# EAGLE design M217A (EAGLE 6.6.0)
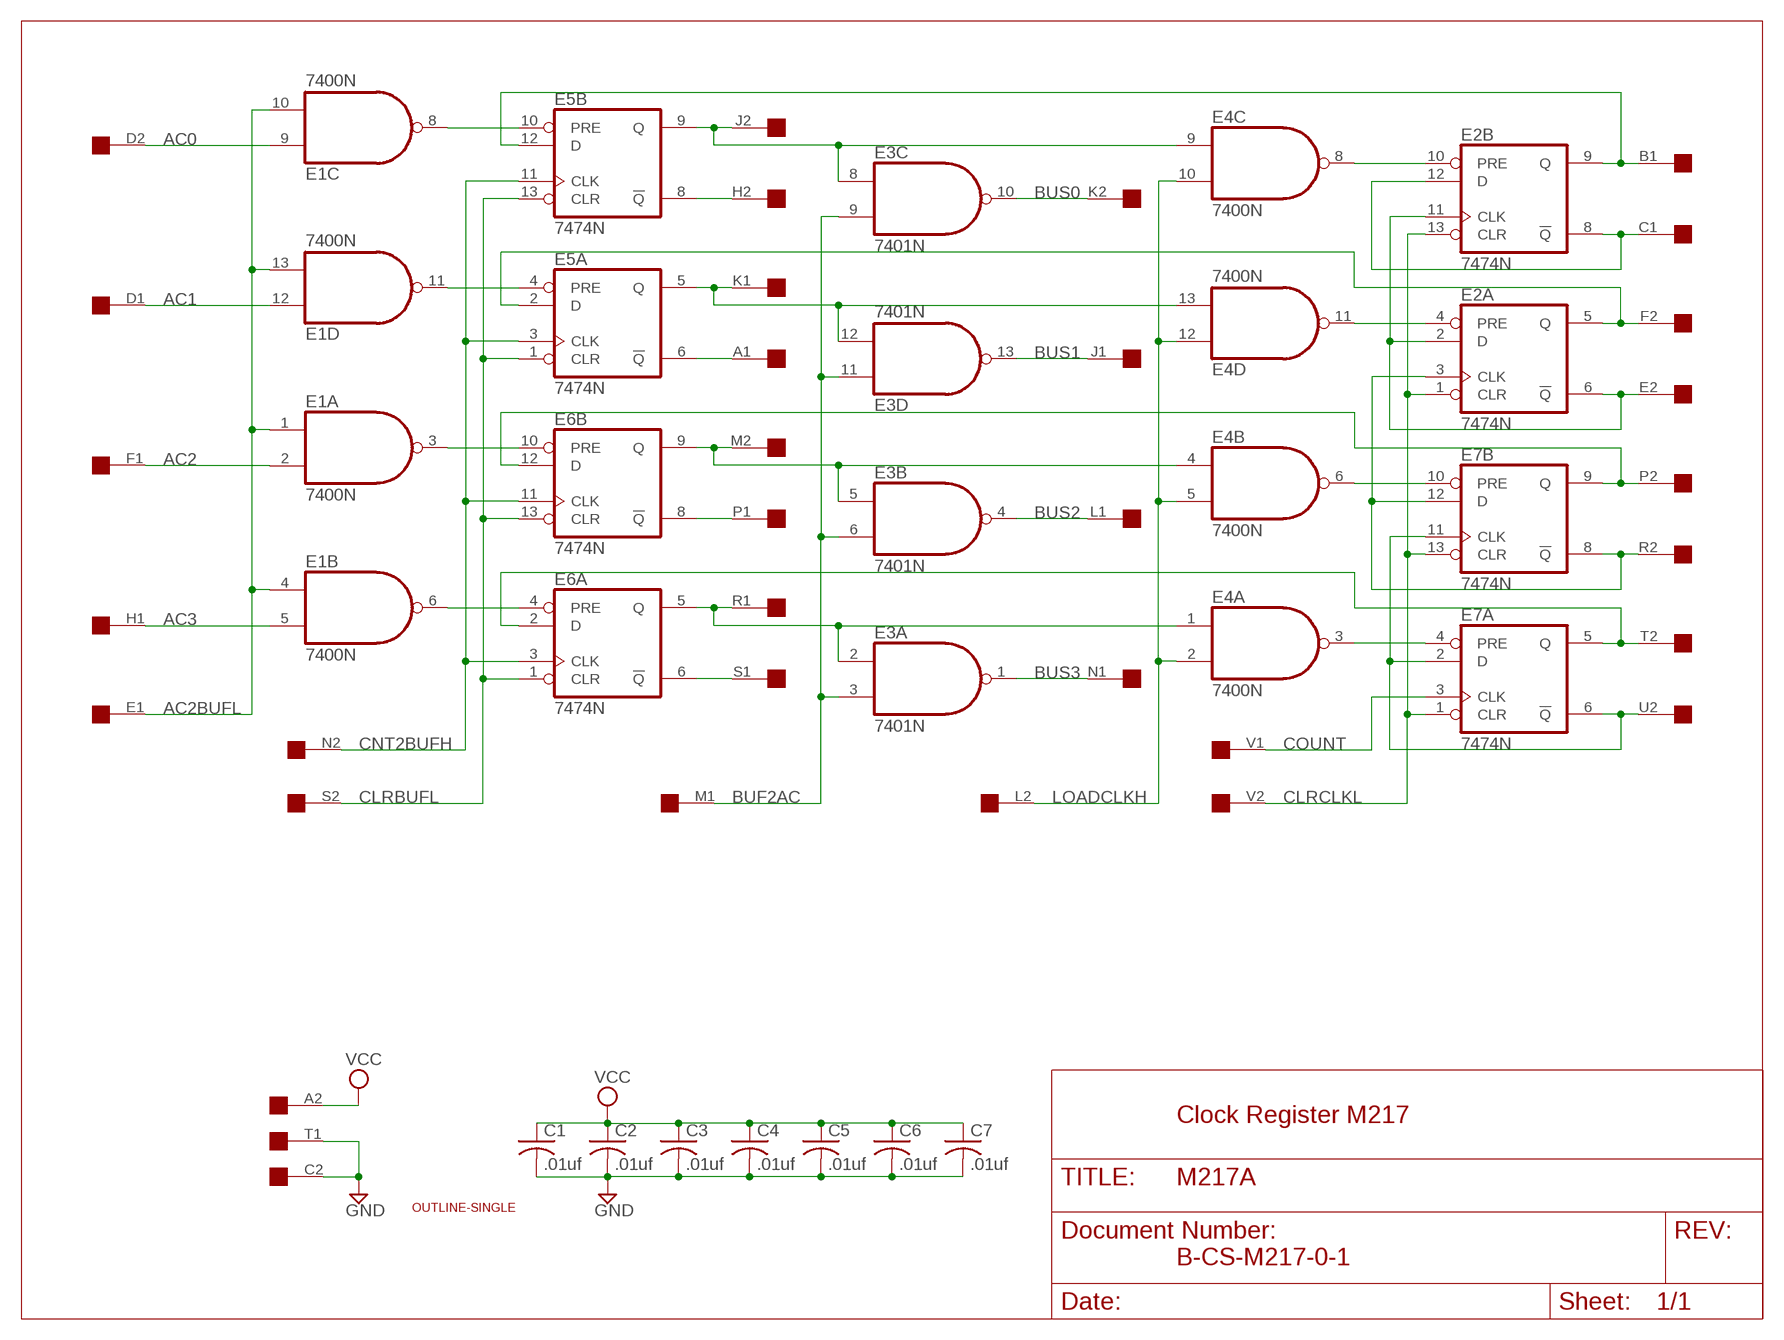
[diagram p0: schematic, sheet 1]

## Parts
C1  .01uf  C-US050-025X075  [C050-025X075]
C2  .01uf  C-US050-025X075  [C050-025X075]
C3  .01uf  C-US050-025X075  [C050-025X075]
C4  .01uf  C-US050-025X075  [C050-025X075]
C5  .01uf  C-US050-025X075  [C050-025X075]
C6  .01uf  C-US050-025X075  [C050-025X075]
C7  .01uf  C-US050-025X075  [C050-025X075]
E1  7400N  [DIL14]
E2  7474N  74S74N  [DIL14]
E3  7401N  74LS01N  [DIL14]
E4  7400N  [DIL14]
E5  7474N  74S74N  [DIL14]
E6  7474N  74S74N  [DIL14]
E7  7474N  74S74N  [DIL14]
U$1  OUTLINE-SINGLE  [SINGLE]
U$4  SINGLE  [EDGE-CON2]

## Nets
AC0: E1.9(C:I0) U$4.D2
AC1: E1.12(D:I0) U$4.D1
AC2: E1.2(A:I1) U$4.F1
AC2BUFL: E1.1(A:I0) E1.4(B:I0) E1.10(C:I1) E1.13(D:I1) U$4.E1
AC3: E1.5(B:I1) U$4.H1
BUF2AC: E3.3(A:I1) E3.6(B:I1) E3.9(C:I1) E3.11(D:I0) U$4.M1
BUS0: E3.10(C:O) U$4.K2
BUS1: E3.13(D:O) U$4.J1
BUS2: E3.4(B:O) U$4.L1
BUS3: E3.1(A:O) U$4.N1
CLRBUFL: E5.1(A:CLR) E5.13(B:CLR) E6.1(A:CLR) E6.13(B:CLR) U$4.S2
CLRCLKL: E2.1(A:CLR) E2.13(B:CLR) E7.1(A:CLR) E7.13(B:CLR) U$4.V2
CNT2BUFH: E5.3(A:CLK) E5.11(B:CLK) E6.3(A:CLK) E6.11(B:CLK) U$4.N2
COUNT: E7.3(A:CLK) U$4.V1
GND [Supply]: C1.2 C2.2 C3.2 C4.2 C5.2 C6.2 C7.2 U$4.C2 U$4.T1
LOADCLKH: E4.2(A:I1) E4.5(B:I1) E4.10(C:I1) E4.12(D:I0) U$4.L2
N$1: E6.12(B:D) E7.9(B:Q) U$4.P2
N$2: E2.5(A:Q) E5.2(A:D) U$4.F2
N$6: E1.6(B:O) E6.4(A:PRE)
N$7: E1.3(A:O) E6.10(B:PRE)
N$8: E1.11(D:O) E5.4(A:PRE)
N$9: E1.8(C:O) E5.10(B:PRE)
N$12: E3.8(C:I0) E4.9(C:I0) E5.9(B:Q) U$4.J2
N$13: E5.8(B:!Q) U$4.H2
N$14: E3.12(D:I1) E4.13(D:I1) E5.5(A:Q) U$4.K1
N$15: E5.6(A:!Q) U$4.A1
N$16: E3.5(B:I0) E4.4(B:I0) E6.9(B:Q) U$4.M2
N$17: E6.8(B:!Q) U$4.P1
N$18: E3.2(A:I0) E4.1(A:I0) E6.5(A:Q) U$4.R1
N$19: E6.6(A:!Q) U$4.S1
N$26: E4.3(A:O) E7.4(A:PRE)
N$27: E4.6(B:O) E7.10(B:PRE)
N$28: E2.4(A:PRE) E4.11(D:O)
N$29: E2.10(B:PRE) E4.8(C:O)
N$31: E7.2(A:D) E7.6(A:!Q) E7.11(B:CLK) U$4.U2
N$32: E6.2(A:D) E7.5(A:Q) U$4.T2
N$33: E2.3(A:CLK) E7.8(B:!Q) E7.12(B:D) U$4.R2
N$35: E2.2(A:D) E2.6(A:!Q) E2.11(B:CLK) U$4.E2
N$37: E2.9(B:Q) E5.12(B:D) U$4.B1
N$38: E2.8(B:!Q) E2.12(B:D) U$4.C1
VCC [Supply]: C1.1 C2.1 C3.1 C4.1 C5.1 C6.1 C7.1 U$4.A2
Unconnected: U$4.B2 U$4.U1

## Notes on the sheet
- Clock Register M217
- B-CS-M217-0-1

## Power pins joined to a net without a drawn wire
GND: E1.7(P:GND) E2.7(P:GND) E3.7(P:GND) E4.7(P:GND) E5.7(P:GND) E6.7(P:GND) E7.7(P:GND)
VCC: E1.14(P:VCC) E2.14(P:VCC) E3.14(P:VCC) E4.14(P:VCC) E5.14(P:VCC) E6.14(P:VCC) E7.14(P:VCC)

## Library data of the parts
C1-C7 = rcl:C-US: CAPACITOR, American symbol
E1 E4 = 74xx-us:74*00: Quad 2-input NAND gate
E2 E5-E7 = 74xx-us:74*74: Dual D type positive edge triggered FLIP FLOP, preset and clear
E3 = 74xx-us:74*01: Quad 2-input NAND gate, open collector
U$1 = dec-con:OUTLINE-*: Board outlines for DEC boards.
U$4 = dec-con:SINGLE: Single-Height DEC board

## Net classes
1 Supply: width 0.813 mm

## Board
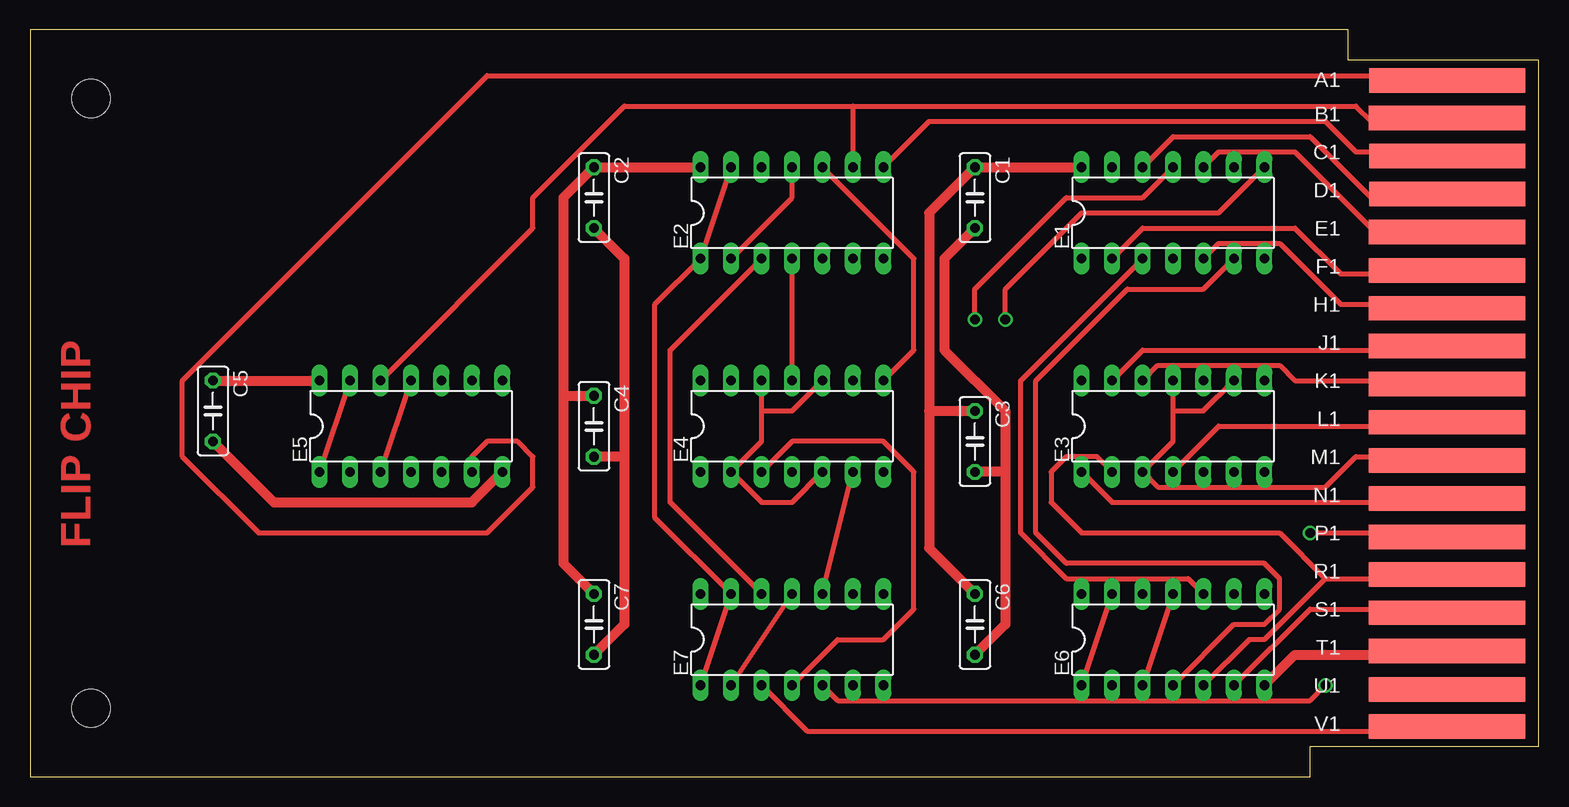
[diagram p1: board, top side]
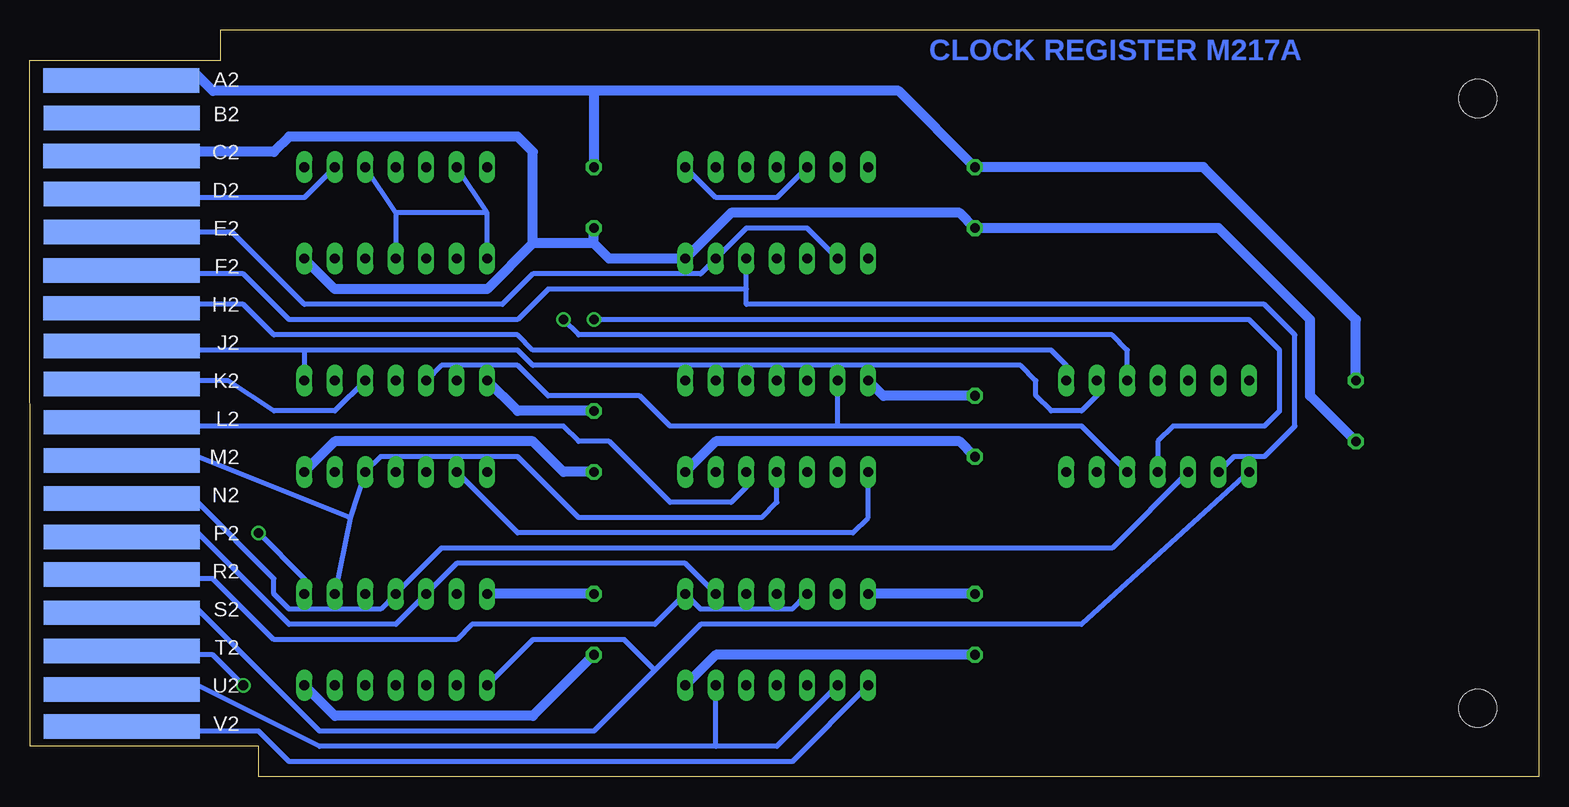
[diagram p2: board, bottom side, seen from below]

Size 125.73 x 62.23 mm. Coordinates in mm from the lower left corner, seen from the top.
Copper layers (1+16): Top 0.035mm / dielectric 1.5mm / Bottom 0.035mm
Design rules "16mils": minimum track width 16mil, minimum drill 32mil, track to track 15mil, track to pad 10mil, pad to pad 10mil, via to via 10mil, smd to smd 10mil, copper to edge 25mil, drill to drill 10mil, minimum pad ring 10mil, minimum via ring 8mil, stop-mask expansion 0mil, vias tented up to drill 0mil, thermal gap 10mil

### Footprints (pad centres in the part's own frame; a part is rotated, then mirrored left to right if it is on the bottom)
C050-025X075 = drill 0.813 octagon: 1 -2.54,0; 2 2.54,0
DIL14 = drill 0.813 long: 1 -7.62,-3.81; 2 -5.08,-3.81; 3 -2.54,-3.81; 4 0,-3.81; 5 2.54,-3.81; 6 5.08,-3.81; 7 7.62,-3.81; 8 7.62,3.81; 9 5.08,3.81; 10 2.54,3.81; 11 0,3.81; 12 -2.54,3.81; 13 -5.08,3.81; 14 -7.62,3.81
SINGLE = hole 3.175: 120.65,56.515; 120.65,5.715
EDGE-CON2 = smd 13.017 x 2.032: A1 7.633,4.207; B1 7.639,7.327; C1 7.636,10.489; D1 7.633,13.665; E1 7.642,16.84; F1 7.642,20.041; H1 7.642,23.19; J1 7.642,26.34; K1 7.642,29.515; L1 7.642,32.69; M1 7.642,35.89; N1 7.642,39.04; P1 7.642,42.24; R1 7.642,45.39; S1 7.642,48.565; T1 7.642,51.74; U1 7.642,54.966; V1 7.642,58.026 | smd 13.017 x 2.032 bottom: A2 7.614,4.207; B2 7.642,7.328; C2 7.617,10.49; D2 7.642,13.665; E2 7.642,16.84; F2 7.617,20.041; H2 7.617,23.19; J2 7.642,26.34; K2 7.642,29.515; L2 7.642,32.69; M2 7.642,35.89; N2 7.642,39.04; P2 7.642,42.24; R2 7.642,45.39; S2 7.642,48.565; T2 7.642,51.74; U2 7.642,54.966; V2 7.642,58.026

### Placement (x,y rotation side)
C1  78.74,48.26 270 top
C2  46.99,48.26 270 top
C3  78.74,27.94 270 top
C4  46.99,29.21 270 top
C5  15.24,30.48 270 top
C6  78.74,12.7 270 top
C7  46.99,12.7 270 top
E1  95.25,46.99 0 top
E2  63.5,46.99 0 top
E3  95.25,29.21 0 top
E4  63.5,29.21 0 top
E5  31.75,29.21 0 top
E6  95.25,11.43 0 top
E7  63.5,11.43 0 top
U$1  125.73,62.23 180 top
U$4  125.73,62.23 180 top
U$5  [FLIPCHIP]  0,0 0 top

### Tracks (layer width: path | path; a pad name or v marks a point on that pad's centre or on a via)
AC0
  Bottom 0.406: U$4.D2 115.88,48.56 115.57,48.26 102.87,48.26 E1.9
AC1
  Top 0.406: U$4.D1 115.88,48.56 115.57,48.26 111.76,48.26 106.68,53.34 95.25,53.34 E1.12
AC2
  Top 0.406: U$4.F1 117.12,42.19 116.84,41.91 109.22,41.91 105.41,45.72 92.71,45.72 E1.2
AC2BUFL
  Top 0.406: U$4.E1 115.9,45.39 115.57,45.72 111.76,45.72 105.41,52.07 99.06,52.07 E1.10
  Bottom 0.406: 95.25,46.99 E1.4 | 95.25,46.99 E1.10 | E1.1 87.63,46.99 | 87.63,46.99 E1.13 | 87.63,46.99 95.25,46.99
AC3
  Top 0.406: U$4.H1 115.9,39.04 115.57,39.37 109.22,39.37 104.14,44.45 99.06,44.45 E1.5
BUF2AC
  Top 0.406: 100.33,24.13 93.98,24.13 E3.3 95.25,27.94 95.25,30.48 | U$4.M1 116.84,26.67 110.49,26.67 107.95,24.13 100.33,24.13 | 100.33,24.13 E3.6 | 95.25,30.48 E3.11 | E3.9 97.79,30.48 95.25,30.48
BUS0
  Bottom 0.406: U$4.K2 116.84,33.02 109.22,33.02 105.41,30.48 100.33,30.48 E3.10
BUS1
  Top 0.406: E3.13 92.71,35.56 116.84,35.56 U$4.J1
BUS2
  Top 0.406: U$4.L1 116.84,29.21 99.06,29.21 E3.4
BUS3
  Top 0.406: U$4.N1 117.17,23.19 116.84,22.86 90.17,22.86 E3.1
CLRBUFL
  Top 0.406: E5.1 E5.13 | E6.1 E6.13
  Bottom 0.406: E5.1 38.1,12.7 69.85,12.7 73.66,8.89 | 73.66,8.89 78.74,3.81 101.6,3.81 111.76,13.97 116.84,13.97 117.14,13.66 U$4.S2 | E6.1 83.82,11.43 76.2,11.43 73.66,8.89
CLRCLKL
  Top 0.406: E7.1 E7.13 52.07,21.59 52.07,39.37 E2.1 E2.13
  Bottom 0.406: U$4.V2 117.23,4.2 116.84,3.81 106.68,3.81 104.14,1.27 62.23,1.27 E7.1
CNT2BUFH
  Top 0.406: E5.3 E5.11 | E6.11 E6.3
  Bottom 0.406: U$4.N2 117.17,23.19 116.84,22.86 111.76,22.86 105.41,16.51 105.41,15.24 104.14,13.97 96.52,13.97 E6.11 91.44,19.05 35.56,19.05 E5.3
COUNT
  Top 0.406: U$4.V1 117.23,4.2 116.84,3.81 64.77,3.81 E7.3
GND
  Top 0.813: C6.2 81.28,12.7 81.28,25.4 | 81.28,25.4 C3.2 | 81.28,25.4 81.28,30.48 76.2,35.56 76.2,43.18 C1.2 | U$4.T1 117.17,10.49 116.84,10.16 105.41,10.16 E6.7 | 49.53,26.67 49.53,12.7 C7.2 | 49.53,26.67 C4.2 | 49.53,26.67 49.53,43.18 C2.2 | E5.7 36.83,22.86 20.32,22.86 C5.2
  Bottom 0.813: U$4.C2 115.9,51.74 115.57,52.07 105.41,52.07 104.14,53.34 85.09,53.34 83.82,52.07 83.82,44.45 | 83.82,44.45 87.63,40.64 100.33,40.64 E1.7 | 78.74,44.45 83.82,44.45 | 78.74,44.45 C1.2 | 78.74,44.45 77.47,43.18 E2.7 67.31,46.99 48.26,46.99 C2.2 26.67,45.72 19.05,38.1 19.05,31.75 C5.2 | C4.2 48.26,27.94 68.58,27.94 E4.7 | E6.7 100.33,5.08 83.82,5.08 C6.2 | C7.2 68.58,10.16 E7.7 | E3.7 100.33,27.94 83.82,27.94 81.28,25.4 C3.2
LOADCLKH
  Top 0.406: E4.5 63.5,22.86 60.96,22.86 E4.2 60.96,27.94 60.96,30.48 | 60.96,30.48 E4.12 | 60.96,30.48 63.5,30.48 E4.10
  Bottom 0.406: E4.5 66.04,24.13 67.31,22.86 72.39,22.86 77.47,27.94 80.01,27.94 81.28,29.21 115.57,29.21 115.9,29.54 U$4.L2
N$1
  Bottom 0.406: U$4.P2 115.9,19.99 115.57,20.32 111.76,20.32 104.14,12.7 95.25,12.7 E6.12 90.17,17.78 71.12,17.78 E7.9
N$2
  Bottom 0.406: E5.2 25.4,26.67 22.86,26.67 20.32,29.21 20.32,36.83 22.86,39.37 66.04,39.37 66.04,40.64 | 66.04,40.64 E2.5 | U$4.F2 117.12,42.19 116.84,41.91 107.95,41.91 104.14,38.1 85.09,38.1 82.55,40.64 66.04,40.64
N$6
  Top 0.406: E6.4 100.33,12.7 102.87,12.7 104.14,13.97 104.14,16.51 102.87,17.78 86.36,17.78 83.82,20.32 83.82,33.02 91.44,40.64 97.79,40.64 E1.6
N$7
  Top 0.406: E6.10 96.52,16.51 86.36,16.51 82.55,20.32 82.55,33.02 E1.3
N$8  (via drill 0.81)
  Top 0.406: v78.74,38.1 78.74,40.64 86.36,48.26 92.71,48.26 E1.11
  Bottom 0.406: E5.4 31.75,27.94 30.48,29.21 22.86,29.21 21.59,30.48 21.59,35.56 24.13,38.1 v78.74,38.1
N$9  (via drill 0.81)
  Top 0.406: v81.28,38.1 81.28,40.64 87.63,46.99 99.06,46.99 E1.8
  Bottom 0.406: E5.10 34.29,35.56 35.56,36.83 80.01,36.83 v81.28,38.1
N$12
  Bottom 0.406: E5.9 36.83,31.75 38.1,30.48 40.64,30.48 41.91,31.75 41.91,33.02 43.18,34.29 68.58,34.29 | 68.58,34.29 E4.9 | 68.58,34.29 83.82,34.29 85.09,35.56 102.87,35.56 | 102.87,35.56 E3.8 | U$4.J2 117.17,35.89 116.84,35.56 102.87,35.56
N$13
  Bottom 0.406: E5.8 39.37,34.29 40.64,35.56 83.82,35.56 85.09,36.83 105.41,36.83 107.95,39.37 116.84,39.37 117.17,39.04 U$4.H2
N$14
  Top 0.406: E3.12 93.98,34.29 104.14,34.29 105.41,33.02 116.84,33.02 U$4.K1
  Bottom 0.406: E5.5 38.1,29.21 58.42,29.21 | 58.42,29.21 72.39,29.21 74.93,31.75 82.55,31.75 85.09,34.29 91.44,34.29 E3.12 | 58.42,29.21 E4.13
N$15
  Top 0.406: U$4.A1 115.97,58.02 115.57,58.42 38.1,58.42 12.7,33.02 12.7,26.67 19.05,20.32 38.1,20.32 41.91,24.13 41.91,26.67 40.64,27.94 38.1,27.94 36.83,26.67 E5.6
N$16
  Bottom 0.406: E4.4 63.5,22.86 64.77,21.59 80.01,21.59 85.09,26.67 96.52,26.67 E3.5 99.06,21.59 | U$4.M2 116.84,26.67 111.76,26.67 99.06,21.59 | 99.06,21.59 E6.9
N$17  (via drill 0.81)
  Top 0.406: U$4.P1 116.84,20.32 v106.68,20.32
  Bottom 0.406: v106.68,20.32 102.87,16.51 E6.8
N$18
  Top 0.406: U$4.R1 115.9,16.84 115.57,16.51 107.95,16.51 | 107.95,16.51 102.87,11.43 101.6,11.43 E6.5 | E3.2 88.9,26.67 86.36,26.67 85.09,25.4 85.09,22.86 87.63,20.32 104.14,20.32 107.95,16.51
  Bottom 0.406: E4.1 55.88,21.59 57.15,20.32 85.09,20.32 E3.2
N$19
  Top 0.406: U$4.S1 117.14,13.66 116.84,13.97 106.68,13.97 E6.6
N$26
  Top 0.406: E4.3 63.5,27.94 71.12,27.94 73.66,25.4 73.66,13.97 71.12,11.43 67.31,11.43 E7.4
N$27
  Top 0.406: E7.10 E4.6
N$28
  Top 0.406: E4.11 E2.4
N$29
  Top 0.406: E4.8 73.66,35.56 73.66,43.18 E2.10
N$31
  Top 0.406: E7.2 E7.11
  Bottom 0.406: U$4.U2 115.93,7.26 115.57,7.62 111.76,7.62 101.6,2.54 68.58,2.54 | 68.58,2.54 E7.6 | E7.2 63.5,2.54 68.58,2.54
N$32  (via drill 0.81)
  Top 0.406: v107.95,7.62 106.68,6.35 90.17,6.35 | 90.17,6.35 E6.2 | E7.5 67.31,6.35 90.17,6.35
  Bottom 0.406: U$4.T2 117.17,10.49 116.84,10.16 110.49,10.16 v107.95,7.62
N$33
  Top 0.406: E7.12 53.34,22.86 53.34,35.56 E2.3
  Bottom 0.406: U$4.R2 115.9,16.84 115.57,16.51 110.49,16.51 105.41,11.43 90.17,11.43 88.9,12.7 73.66,12.7 E7.8 69.85,13.97 62.23,13.97 E7.12
N$35
  Top 0.406: E2.11 63.5,48.26 E2.2
  Bottom 0.406: E2.2 60.96,45.72 66.04,45.72 E2.6 69.85,41.91 83.82,41.91 86.36,39.37 102.87,39.37 108.89,45.39 U$4.E2
N$37
  Top 0.406: U$4.B1 115.86,54.9 115.57,54.61 111.76,54.61 110.49,55.88 68.58,55.88 | 68.58,55.88 49.53,55.88 41.91,48.26 41.91,45.72 E5.12 | 68.58,55.88 E2.9
N$38
  Top 0.406: U$4.C1 115.9,51.74 115.57,52.07 110.49,52.07 107.95,54.61 74.93,54.61 E2.8
  Bottom 0.406: E2.12 63.5,48.26 68.58,48.26 E2.8
VCC
  Top 0.813: E1.14 C1.1 74.93,46.99 74.93,30.48 | 74.93,30.48 C3.1 | C6.1 74.93,19.05 74.93,30.48 | C7.1 44.45,17.78 44.45,31.75 | 44.45,31.75 44.45,48.26 C2.1 E2.14 | C5.1 E5.14 | 44.45,31.75 C4.1
  Bottom 0.813: U$4.A2 117.24,58.02 116.84,58.42 111.76,58.42 110.49,57.15 78.74,57.15 | 78.74,57.15 C1.1 | 78.74,57.15 53.34,57.15 C2.1 27.94,50.8 15.24,38.1 C5.1 | E3.14 85.09,30.48 C3.1 | C6.1 E6.14 | C7.1 E7.14 | C4.1 54.61,31.75 E4.14

### Text on the board
Bottom: CLOCK REGISTER M217A